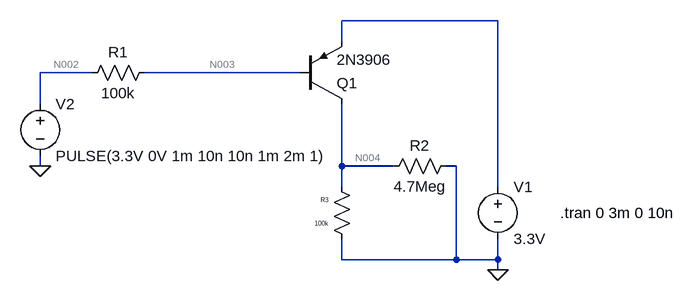
[diagram p0: schematic RiseTimeTest.asc]
RiseTimeTest.asc, the LTspice schematic file:
Version 4
SHEET 1 956 680
WIRE 672 96 432 96
WIRE 432 128 432 96
WIRE 48 176 -32 176
WIRE 368 176 128 176
WIRE -32 224 -32 176
WIRE -32 320 -32 304
WIRE 432 320 432 224
WIRE 512 320 432 320
WIRE 608 320 592 320
WIRE 432 352 432 320
WIRE 672 352 672 96
WIRE 432 464 432 432
WIRE 608 464 608 320
WIRE 608 464 432 464
WIRE 672 464 672 432
WIRE 672 464 608 464
WIRE 672 480 672 464
FLAG 672 480 0
FLAG -32 320 0
SYMBOL res 144 160 R90
WINDOW 0 0 56 VBottom 2
WINDOW 3 32 56 VTop 2
SYMATTR InstName R1
SYMATTR Value 100k
SYMBOL res 608 304 R90
WINDOW 0 0 56 VBottom 2
WINDOW 3 32 56 VTop 2
SYMATTR InstName R2
SYMATTR Value 4.7Meg
SYMBOL voltage 672 336 R0
SYMATTR InstName V1
SYMATTR Value 3.3V
SYMBOL voltage -32 208 R0
SYMATTR InstName V2
SYMATTR Value PULSE(3.3V 0V 1m 10n 10n 1m 2m 1)
SYMBOL res 448 448 R180
WINDOW 0 36 76 Left 0
WINDOW 3 36 40 Left 0
SYMATTR InstName R3
SYMATTR Value 100k
SYMBOL pnp 368 224 M180
SYMATTR InstName Q1
SYMATTR Value 2N3906
TEXT 768 392 Left 2 !.tran 0 3m 0 10n

The netlist it stands for:
* RiseTimeTest.asc
R1 N003 N002 100k
R2 0 N004 4.7Meg
V1 N001 0 3.3V
V2 N002 0 PULSE(3.3V 0V 1m 10n 10n 1m 2m 1)
R3 0 N004 100k
Q1 N004 N003 N001 0 2N3906
.model NPN NPN
.model PNP PNP
.lib standard.bjt
.tran 0 3m 0 10n
.backanno
.end

* Results of the author's LTspice run, read from the files saved beside the schematic
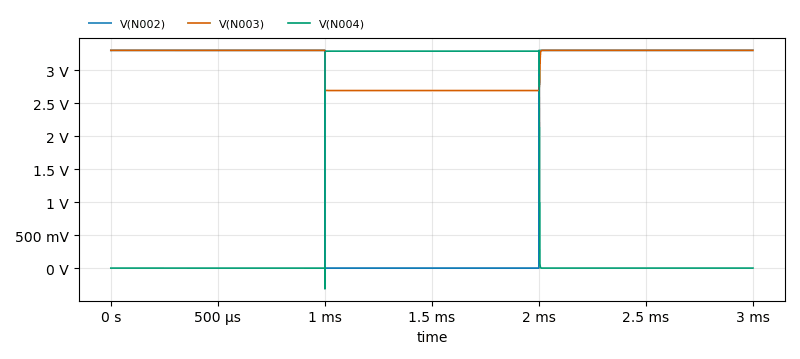
[diagram p1: Transient Analysis of RiseTimeTest.asc, plotted from the saved traces]
* Transient Analysis, 1 run:
*   V(N002): min 0 V, max 3.3 V, average 2.2 V, rms 2.694 V, last 3.3 V
*   V(N003): min 2.691 V, max 3.3 V, average 3.096 V, rms 3.109 V, last 3.3 V
*   V(N004): min -313.9 mV, max 3.292 V, average 1.099 V, rms 1.9 V, last 0 V